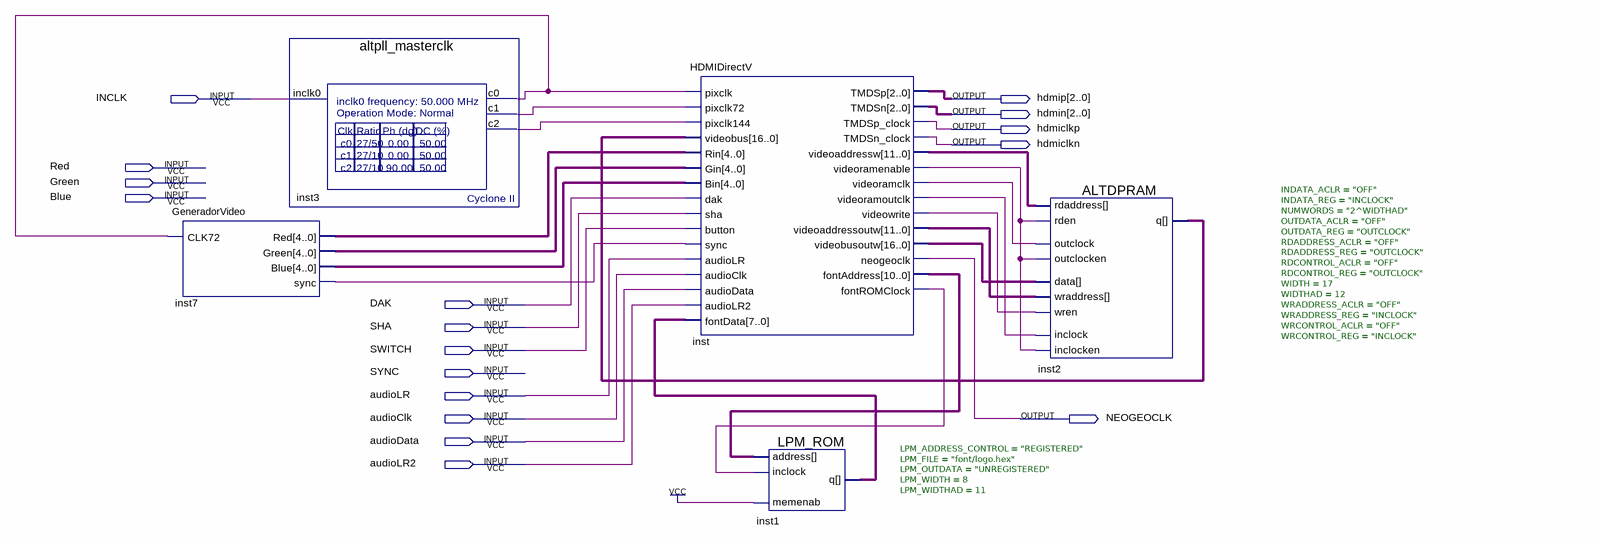
[diagram p0: schematic sheet]
// Quartus schematic HDMIDirect.bdf as structural Verilog: 5 symbols, 17 pins
module HDMIDirect (
  input  INCLK,
  input  Red,
  input  Green,
  input  Blue,
  input  DAK,
  input  SHA,
  input  SWITCH,
  input  SYNC,
  input  audioLR,
  input  audioClk,
  input  audioData,
  input  audioLR2,
  output [2:0] hdmip,
  output [2:0] hdmin,
  output hdmiclkp,
  output hdmiclkn,
  output NEOGEOCLK
);

  wire inst3_c0, inst3_c1, inst3_c2, inst7_sync, inst_fontromclock, inst_videoramclk, inst_videoramenable,
       inst_videoramoutclk, inst_videowrite;
  wire [4:0] inst7_blue, inst7_green, inst7_red;
  wire [7:0] inst1_q;
  wire [10:0] inst_fontaddress;
  wire [11:0] inst_videoaddressoutw, inst_videoaddressw;
  wire [16:0] inst2_q, inst_videobusoutw;

  GeneradorVideo inst7 (.CLK72(inst3_c0), .Red(inst7_red), .Green(inst7_green), .Blue(inst7_blue), .sync(inst7_sync));
  altpll_masterclk inst3 (.inclk0(INCLK), .c0(inst3_c0), .c1(inst3_c1), .c2(inst3_c2));
  HDMIDirectV inst (
    .pixclk(inst3_c0), .pixclk72(inst3_c1), .pixclk144(inst3_c2), .videobus(inst2_q), .Rin(inst7_red),
    .Gin(inst7_green), .Bin(inst7_blue), .dak(DAK), .sha(SHA), .button(SWITCH), .sync(inst7_sync),
    .audioLR(audioLR), .audioClk(audioClk), .audioData(audioData), .audioLR2(audioLR2), .fontData(inst1_q),
    .TMDSp(hdmip), .TMDSn(hdmin), .TMDSp_clock(hdmiclkp), .TMDSn_clock(hdmiclkn),
    .videoaddressw(inst_videoaddressw), .videoramenable(inst_videoramenable), .videoramclk(inst_videoramclk),
    .videoramoutclk(inst_videoramoutclk), .videowrite(inst_videowrite),
    .videoaddressoutw(inst_videoaddressoutw), .videobusoutw(inst_videobusoutw), .neogeoclk(NEOGEOCLK),
    .fontAddress(inst_fontaddress), .fontROMClock(inst_fontromclock));
  LPM_ROM #(.LPM_ADDRESS_CONTROL("REGISTERED"), .LPM_FILE("font/logo.hex"), .LPM_OUTDATA("UNREGISTERED"), .LPM_WIDTH(8), .LPM_WIDTHAD(11)) inst1 (
    .address(inst_fontaddress), .inclock(inst_fontromclock), .memenab(1'b1), .q(inst1_q));
  ALTDPRAM #(.INDATA_ACLR("OFF"), .INDATA_REG("INCLOCK"), .NUMWORDS("2^WIDTHAD"), .OUTDATA_ACLR("OFF"), .OUTDATA_REG("OUTCLOCK"), .RDADDRESS_ACLR("OFF"), .RDADDRESS_REG("OUTCLOCK"), .RDCONTROL_ACLR("OFF"), .RDCONTROL_REG("OUTCLOCK"), .WIDTH(17), .WIDTHAD(12), .WRADDRESS_ACLR("OFF"), .WRADDRESS_REG("INCLOCK"), .WRCONTROL_ACLR("OFF"), .WRCONTROL_REG("INCLOCK")) inst2 (
    .data(inst_videobusoutw), .inclock(inst_videoramoutclk), .inclocken(inst_videoramenable),
    .outclock(inst_videoramclk), .outclocken(inst_videoramenable), .rdaddress(inst_videoaddressw),
    .rden(inst_videoramenable), .wraddress(inst_videoaddressoutw), .wren(inst_videowrite), .q(inst2_q));
endmodule
